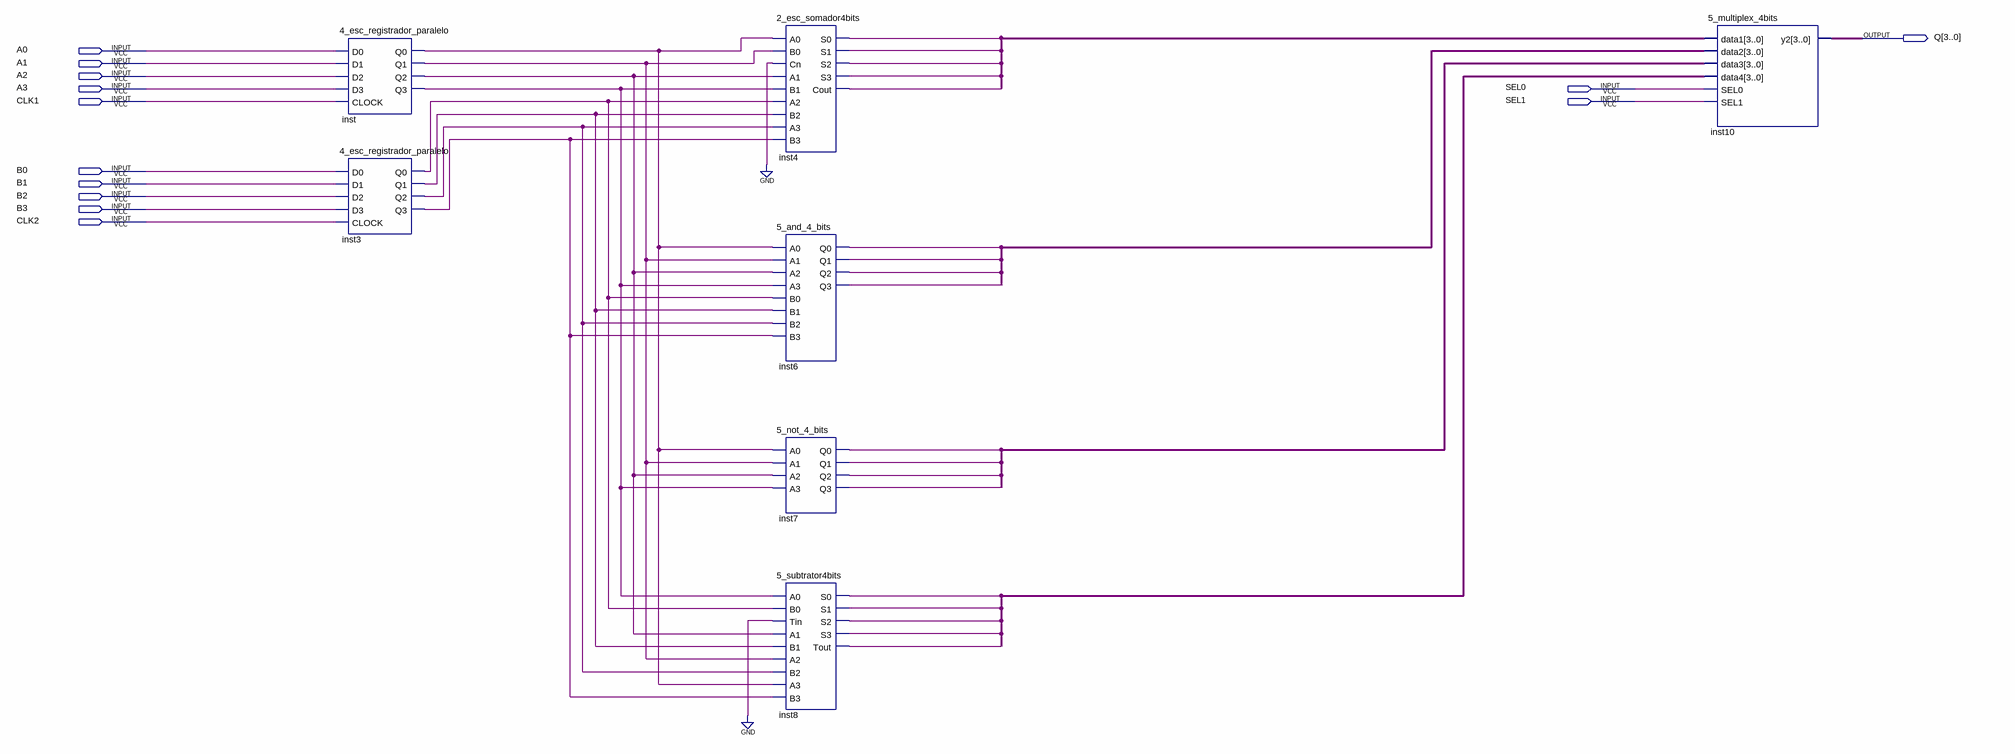
[diagram p0: schematic sheet]
// Quartus schematic 5_esc_ULA.bdf as structural Verilog: 7 symbols, 13 pins
module \5_esc_ULA  (
  input  A0,
  input  A1,
  input  A2,
  input  A3,
  input  SEL0,
  input  CLK1,
  input  SEL1,
  input  B0,
  input  B1,
  input  B2,
  input  B3,
  input  CLK2,
  output [3:0] Q
);

  wire inst3_q0, inst3_q1, inst3_q2, inst3_q3, inst4_cout, inst4_s0, inst4_s1, inst4_s2, inst4_s3, inst6_q0,
       inst6_q1, inst6_q2, inst6_q3, inst7_q0, inst7_q1, inst7_q2, inst7_q3, inst8_s0, inst8_s1, inst8_s2,
       inst8_s3, inst8_tout, inst_q0, inst_q1, inst_q2, inst_q3;
  wire [3:0] undriven, undriven_2, undriven_3, undriven_4;

  \4_esc_registrador_paralelo  inst (
    .D0(A0), .D1(A1), .D2(A2), .D3(A3), .CLOCK(CLK1), .Q0(inst_q0), .Q1(inst_q1), .Q2(inst_q2), .Q3(inst_q3));
  \4_esc_registrador_paralelo  inst3 (
    .D0(B0), .D1(B1), .D2(B2), .D3(B3), .CLOCK(CLK2), .Q0(inst3_q0), .Q1(inst3_q1), .Q2(inst3_q2),
    .Q3(inst3_q3));
  \2_esc_somador4bits  inst4 (
    .A0(inst_q0), .B0(inst_q1), .Cn(1'b0), .A1(inst_q2), .B1(inst_q3), .A2(inst3_q0), .B2(inst3_q1),
    .A3(inst3_q2), .B3(inst3_q3), .S0(inst4_s0), .S1(inst4_s1), .S2(inst4_s2), .S3(inst4_s3),
    .Cout(inst4_cout));
  \5_and_4_bits  inst6 (
    .A0(inst_q0), .A1(inst_q1), .A2(inst_q2), .A3(inst_q3), .B0(inst3_q0), .B1(inst3_q1), .B2(inst3_q2),
    .B3(inst3_q3), .Q0(inst6_q0), .Q1(inst6_q1), .Q2(inst6_q2), .Q3(inst6_q3));
  \5_not_4_bits  inst7 (
    .A0(inst_q0), .A1(inst_q1), .A2(inst_q2), .A3(inst_q3), .Q0(inst7_q0), .Q1(inst7_q1), .Q2(inst7_q2),
    .Q3(inst7_q3));
  \5_subtrator4bits  inst8 (
    .A0(inst_q3), .B0(inst3_q0), .Tin(1'b0), .A1(inst_q2), .B1(inst3_q1), .A2(inst_q1), .B2(inst3_q2),
    .A3(inst_q0), .B3(inst3_q3), .S0(inst8_s0), .S1(inst8_s1), .S2(inst8_s2), .S3(inst8_s3), .Tout(inst8_tout));
  \5_multiplex_4bits  inst10 (
    .data1(undriven), .data2(undriven_2), .data3(undriven_3), .data4(undriven_4), .SEL0(SEL0), .SEL1(SEL1),
    .y2(Q));
endmodule
